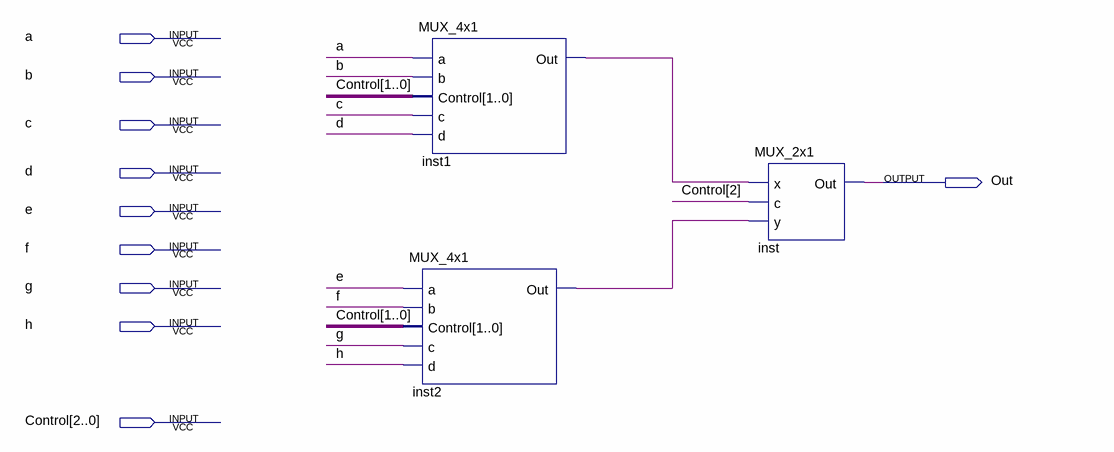
[diagram p0: schematic sheet]
// Quartus schematic MUX_8x1.bdf as structural Verilog: 3 symbols, 10 pins
module MUX_8x1 (
  input  a,
  input  b,
  input  c,
  input  d,
  input  e,
  input  f,
  input  g,
  input  h,
  input  [2:0] Control,
  output Out
);

  wire inst1_out, inst2_out;

  MUX_4x1 inst2 (.a(e), .b(f), .Control(Control[1:0]), .c(g), .d(h), .Out(inst2_out));
  MUX_4x1 inst1 (.a(a), .b(b), .Control(Control[1:0]), .c(c), .d(d), .Out(inst1_out));
  MUX_2x1 inst (.x(inst1_out), .c(Control[2]), .y(inst2_out), .Out(Out));
endmodule
